# Altium schematic sheet ECG 12ch.SchDoc
size A4
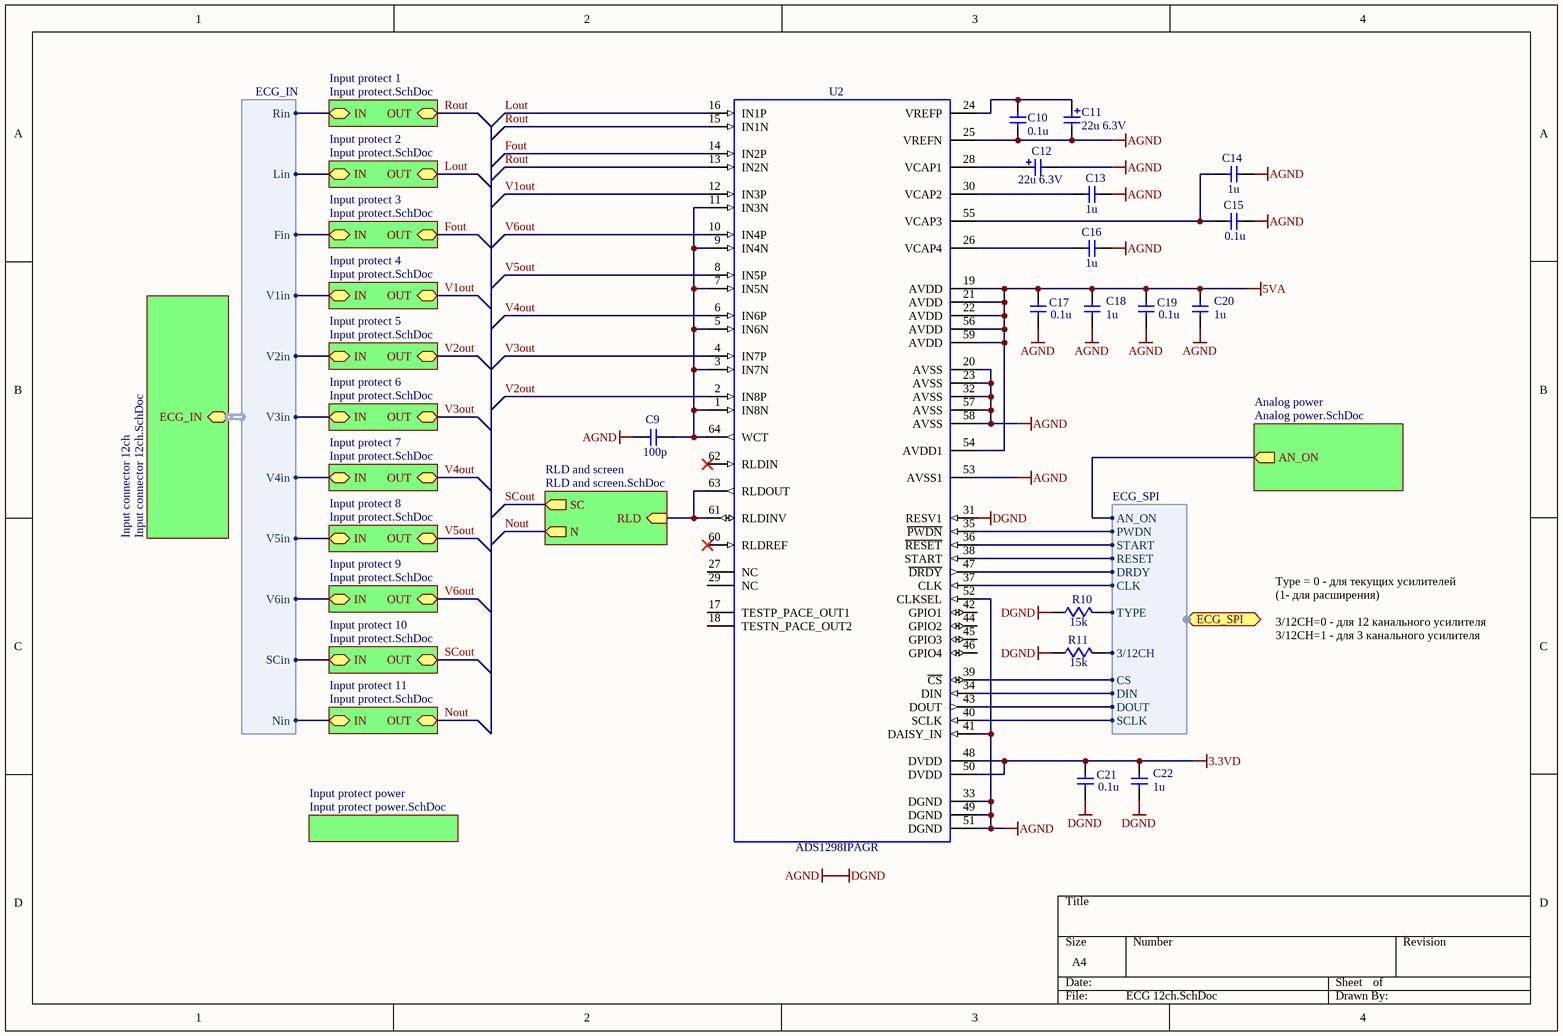
[diagram p0: ECG 12ch.SchDoc]

## Parts
C9  100p  [SMD/C/0603]
C10  0.1u  [SMD/C/0603]
C11  22u 6.3V  [SMD/C/TAJ-A]
C12  22u 6.3V  [SMD/C/TAJ-A]
C13  1u  [SMD/C/0603]
C14  1u  [SMD/C/0603]
C15  0.1u  [SMD/C/0603]
C16  1u  [SMD/C/0603]
C17  0.1u  [SMD/C/0603]
C18  1u  [SMD/C/0603]
C19  0.1u  [SMD/C/0603]
C20  1u  [SMD/C/0603]
C21  0.1u  [SMD/C/0603]
C22  1u  [SMD/C/0603]
R10  15k  [SMD/R/0603]
R11  15k  [SMD/R/0603]
U2  ADS1298IPAGR  [SMD/QFP64/0.5MMP/10x10MM/12X12MMWP]

## Sub-sheets
Analog power = Analog power.SchDoc: AN_ON (out)
Input connector 12ch = Input connector 12ch.SchDoc: ECG_IN (harness ECG_IN)
Input protect 1 = Input protect.SchDoc: IN, OUT
Input protect 2 = Input protect.SchDoc: IN, OUT
Input protect 3 = Input protect.SchDoc: IN, OUT
Input protect 4 = Input protect.SchDoc: IN, OUT
Input protect 5 = Input protect.SchDoc: IN, OUT
Input protect 6 = Input protect.SchDoc: IN, OUT
Input protect 7 = Input protect.SchDoc: IN, OUT
Input protect 8 = Input protect.SchDoc: IN, OUT
Input protect 9 = Input protect.SchDoc: IN, OUT
Input protect 10 = Input protect.SchDoc: IN, OUT
Input protect 11 = Input protect.SchDoc: IN, OUT
Input protect power = Input protect power.SchDoc: no entries
RLD and screen = RLD and screen.SchDoc: SC (out), N (out), RLD (in)

## Ports
ECG_SPI (harness ECG_SPI)

## Harnesses
ECG_SPI: PWDN, START, DRDY, CLK, DIN, CS, DOUT, SCLK, RESET, 3/12CH, TYPE, AN_ON
ECG_IN: Rin, Lin, Fin, V1in, V2in, V3in, V4in, V5in, V6in, SCin, Nin

## Nets
3.3VD: C21.2 C22.2 U2.48(DVDD) U2.50(DVDD)
5VA: C17.2 C18.2 C19.2 C20.2 U2.19(AVDD) U2.21(AVDD) U2.22(AVDD) U2.54(AVDD1) U2.56(AVDD) U2.59(AVDD)
AGND: C9.2 C10.1 C11.M C12.M C13.1 C14.1 C15.1 C16.1 C17.1 C18.1 C19.1 C20.1 C21.1 C22.1 R10.1 R11.1 U2.20(AVSS) U2.23(AVSS) U2.25(VREFN) U2.31(RESV1) U2.32(AVSS) U2.33(DGND) U2.41(DAISY_IN) U2.49(DGND) U2.51(DGND) U2.52(CLKSEL) U2.53(AVSS1) U2.57(AVSS) U2.58(AVSS)  [also labelled DGND]
Fout: U2.14(IN2P) ; sheet Input protect 3/OUT
Lout: U2.16(IN1P) ; sheet Input protect 2/OUT
Nout: sheet Input protect 11/OUT, sheet RLD and screen/N
Rout: U2.13(IN2N) U2.15(IN1N) ; sheet Input protect 1/OUT
SCout: sheet Input protect 10/OUT, sheet RLD and screen/SC
V1out: U2.12(IN3P) ; sheet Input protect 4/OUT
V2out: U2.2(IN8P) ; sheet Input protect 5/OUT
V3out: U2.4(IN7P) ; sheet Input protect 6/OUT
V4out: U2.6(IN6P) ; sheet Input protect 7/OUT
V5out: U2.8(IN5P) ; sheet Input protect 8/OUT
V6out: U2.10(IN4P) ; sheet Input protect 9/OUT
NetC9_1: C9.1 U2.1(IN8N) U2.3(IN7N) U2.5(IN6N) U2.7(IN5N) U2.9(IN4N) U2.11(IN3N) U2.64(WCT)
NetC10_2: C10.2 C11.P U2.24(VREFP)
NetC12_P: C12.P U2.28(VCAP1)
NetC13_2: C13.2 U2.30(VCAP2)
NetC14_2: C14.2 C15.2 U2.55(VCAP3)
NetC16_2: C16.2 U2.26(VCAP4)
NetR10_2: R10.2 ; port ECG_SPI.TYPE
NetR11_2: R11.2 ; port ECG_SPI.3/12CH
NetU2_34: U2.34(DIN) ; port ECG_SPI.DIN
NetU2_35: U2.35(~{PWDN}) ; port ECG_SPI.PWDN
NetU2_36: U2.36(~{RESET}) ; port ECG_SPI.START
NetU2_37: U2.37(CLK) ; port ECG_SPI.CLK
NetU2_38: U2.38(START) ; port ECG_SPI.RESET
NetU2_39: U2.39(~{CS}) ; port ECG_SPI.CS
NetU2_40: U2.40(SCLK) ; port ECG_SPI.SCLK
NetU2_43: U2.43(DOUT) ; port ECG_SPI.DOUT
NetU2_47: U2.47(~{DRDY}) ; port ECG_SPI.DRDY
NetU2_61: U2.61(RLDINV) U2.63(RLDOUT) ; sheet RLD and screen/RLD
(unnamed): sheet Input protect 1/IN, sheet Input connector 12ch/ECG_IN.Rin
(unnamed): sheet Input protect 2/IN, sheet Input connector 12ch/ECG_IN.Lin
(unnamed): sheet Input protect 4/IN, sheet Input connector 12ch/ECG_IN.V1in
(unnamed): sheet Input protect 5/IN, sheet Input connector 12ch/ECG_IN.V2in
(unnamed): sheet Input protect 6/IN, sheet Input connector 12ch/ECG_IN.V3in
(unnamed): sheet Input protect 7/IN, sheet Input connector 12ch/ECG_IN.V4in
(unnamed): sheet Input protect 8/IN, sheet Input connector 12ch/ECG_IN.V5in
(unnamed): sheet Input protect 9/IN, sheet Input connector 12ch/ECG_IN.V6in
(unnamed): sheet Input protect 10/IN, sheet Input connector 12ch/ECG_IN.SCin
(unnamed): sheet Input protect 11/IN, sheet Input connector 12ch/ECG_IN.Nin
(unnamed): sheet Input protect 3/IN, sheet Input connector 12ch/ECG_IN.Fin
(unnamed): sheet Analog power/AN_ON, port ECG_SPI.AN_ON

Not connected (* = marked no-connect by the designer): U2 17(TESTP_PACE_OUT1) 18(TESTN_PACE_OUT2) 27(NC) 29(NC) 42(GPIO1) 44(GPIO2) 45(GPIO3) 46(GPIO4) 60(RLDREF)* 62(RLDIN)*

## Notes on the sheet
- Type = 0 - для текущих усилителей
  (1- для расширения)
  3/12CH=0 - для 12 канального усилителя
  3/12CH=1 - для 3 канального усилителя

## Library data of the parts
C9 C10 C13-C22 = Capacitor
  C9: Value: 100p
  C10 C15 C17 C19 C21: Value: 0.1u
  C13 C14 C16 C18 C20 C22: Value: 1u
C11 C12 = Capacitor Pol: Value: 22u 6.3V
R10 R11 = Resistor: Value: 15k
U2 = ADS1298IPAGR: Interleaving Continuous Conduction Mode PFC Controller; Value: ADS1298IPAGR